# Altium schematic sheet POWER.SchDoc
size A; SheetNumber: 5; SheetTotal: 6
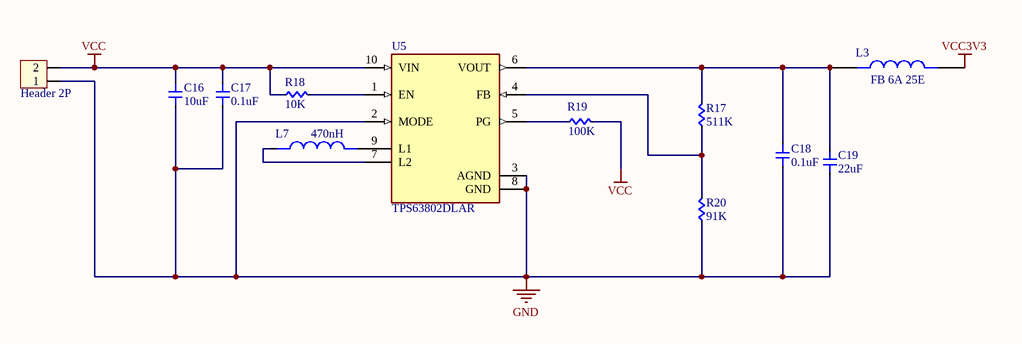
[diagram p0: POWER.SchDoc]

## Parts
C16  10uF  [Cap 0805]
C17  0.1uF  [Cap 0805]
C18  0.1uF  [Cap 0805]
C19  22uF  [Cap 0805]
H1  Header 2P  [XH2.54M-2]
L3  FB 6A 25E  [INDC2012X145N]
L7  470nH  [CUON CAM SMD 0530]
R17  511K  [RES 0805]
R18  10K  [RES 0805]
R19  100K  [RES 0805]
R20  91K  [RES 0805]
U5  TPS63802DLAR  [VREG_TPS63802DLAR]

## Nets
GND: C16.2 C17.2 C18.2 C19.2 H1.1 R20.1 U5.2(MODE) U5.3(AGND) U5.8(GND)
VCC: C16.1 C17.1 H1.2 R18.1 R19.2 U5.10(VIN)
VCC3V3: L3.2
NetC18_1: C18.1 C19.1 L3.1 R17.2 U5.6(VOUT)
NetL7_1: L7.1 U5.7(L2)
NetL7_2: L7.2 U5.9(L1)
NetR17_1: R17.1 R20.2 U5.4(FB)
NetR18_2: R18.2 U5.1(EN)
NetR19_1: R19.1 U5.5(PG)

## Library data of the parts
C16-C19 = Cap 0805: Capacitor SMD 0805
H1 = Header 2P 2.54 Duc Thang: Cắm; Ten_Linh_Kien: Header 2P XH2.54-2P Đực Thẳng; Don_Vi: Con; Ma_Hang: MH001283; Chung_Loai: Cắm
L3 = MLZ2012N220LT000: 22 ÂµH Shielded Multilayer Inductor 300 mA 670mOhm 0805 (2012 Metric); MF: TDK; SnapEDA_Link: https://www.snapeda.com/parts/MLZ2012N220LT000/TDK/view-part/?ref=snap; Package: 2012 Bourns; Value: *; MP: MLZ2012N220LT000; Check_prices: https://www.snapeda.com/parts/MLZ2012N220LT000/TDK/view-part/?ref=eda
L7 = Cuon Cam SMD 0530: SMD 0530; MP: FDV0530-H-1R5M=P3; Package: None; Price: None; Value: *; Availability: Unavailable
R17 R19 R20 = RES 0805: RES SMD 0805; Manufacturer: Vishay Dale; Manufacturer Part Number: CRCW040210K0FKED; Resistance (Ohms): 10k; Tolerance: ±1%; Power (Watts): 0.063W, 1/16W; Temperature Coefficient: ±100ppm/°C; Supplier 1: Digi-Key; RoHS: RoHS Compliant; Category: Resistors; Stock 1: 2392462; Pricing 1: 10=0.083, 50=0.0444, 200=0.0255, 1000=0.0174 (USD); Packaging: Cut Tape (CT); Composition: Thick Film; Features: Automotive AEC-Q200; Operating Temperature: -55°C ~ 155°C; Package / Case: 0402 (1005 Metric); Supplier Device Package: 0402 (1005 Metric); Size / Dimension: 0.039" L x 0.020" W (1.00mm x 0.50mm); Height: 0.016" (0.40mm); Number of Terminations: 2; ComponentLink1URL: http://www.vishay.com/docs/20035/dcrcwe3.pdf; ComponentLink1Description: http://www.vishay.com/docs/20035/dcrcwe3.pdf; Supplier Part Number 1: 541-10.0KLCT-ND
R18 = RES 0805: RES SMD 0805; Manufacturer: Vishay Dale; Manufacturer Part Number: CRCW040210K0FKED; Tolerance: ±1%; Power (Watts): 0.063W, 1/16W; Temperature Coefficient: ±100ppm/°C; Supplier 1: Digi-Key; RoHS: RoHS Compliant; Category: Resistors; Stock 1: 2392462; Pricing 1: 10=0.083, 50=0.0444, 200=0.0255, 1000=0.0174 (USD); Packaging: Cut Tape (CT); Resistance (Ohms): 10k; Composition: Thick Film; Features: Automotive AEC-Q200; Operating Temperature: -55°C ~ 155°C; Package / Case: 0402 (1005 Metric); Supplier Device Package: 0402 (1005 Metric); Size / Dimension: 0.039" L x 0.020" W (1.00mm x 0.50mm); Height: 0.016" (0.40mm); Number of Terminations: 2; ComponentLink1URL: http://www.vishay.com/docs/20035/dcrcwe3.pdf; ComponentLink1Description: http://www.vishay.com/docs/20035/dcrcwe3.pdf; Supplier Part Number 1: 541-10.0KLCT-ND
U5 = TPS63802DLAR: 2-A, high-efficient, 11-ÂµA quiescent current buck-boost converter in QFN/DFN package; MF: Texas Instruments; SnapEDA_Link: https://www.snapeda.com/parts/TPS63802DLAR/Texas+Instruments/view-part/?ref=snap; Package: VSON-HR-10 Texas Instruments; Value: *; MP: TPS63802DLAR; Check_prices: https://www.snapeda.com/parts/TPS63802DLAR/Texas+Instruments/view-part/?ref=eda